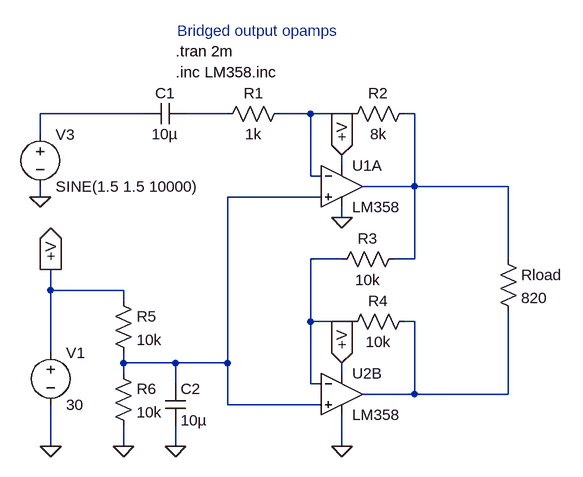
[diagram p0: schematic bridge_output_opamp.asc]
bridge_output_opamp.asc, the LTspice schematic file:
Version 4
SHEET 1 880 680
WIRE -512 -320 -672 -320
WIRE -384 -320 -448 -320
WIRE -256 -320 -304 -320
WIRE -192 -320 -256 -320
WIRE -96 -320 -112 -320
WIRE -672 -288 -672 -320
WIRE -208 -240 -208 -256
WIRE -256 -224 -256 -320
WIRE -240 -224 -256 -224
WIRE -96 -208 -96 -320
WIRE -96 -208 -176 -208
WIRE 48 -208 -96 -208
WIRE -672 -192 -672 -208
WIRE -240 -192 -384 -192
WIRE -208 -160 -208 -176
WIRE -208 -96 -256 -96
WIRE -96 -96 -96 -208
WIRE -96 -96 -128 -96
WIRE 48 -96 48 -208
WIRE -656 -48 -656 -80
WIRE -544 -48 -656 -48
WIRE -544 -32 -544 -48
WIRE -256 0 -256 -96
WIRE -192 0 -256 0
WIRE -96 0 -112 0
WIRE -656 48 -656 -48
WIRE -544 64 -544 48
WIRE -464 64 -544 64
WIRE -384 64 -384 -192
WIRE -384 64 -464 64
WIRE -544 80 -544 64
WIRE -208 80 -208 64
WIRE -464 96 -464 64
WIRE -256 96 -256 0
WIRE -240 96 -256 96
WIRE -96 112 -96 0
WIRE -96 112 -176 112
WIRE 48 112 48 -16
WIRE 48 112 -96 112
WIRE -384 128 -384 64
WIRE -240 128 -384 128
WIRE -656 192 -656 128
WIRE -544 192 -544 160
WIRE -464 192 -464 160
WIRE -208 192 -208 144
FLAG -656 192 0
FLAG -208 64 +V
IOPIN -208 64 In
FLAG -656 -80 +V
IOPIN -656 -80 Out
FLAG -208 -256 +V
IOPIN -208 -256 In
FLAG -544 192 0
FLAG -464 192 0
FLAG -672 -192 0
FLAG -208 -160 0
FLAG -208 192 0
SYMBOL voltage -656 32 R0
WINDOW 123 0 0 Left 2
WINDOW 39 0 0 Left 2
SYMATTR InstName V1
SYMATTR Value 30
SYMBOL res -96 -16 R90
WINDOW 0 0 56 VBottom 2
WINDOW 3 32 56 VTop 2
SYMATTR InstName R4
SYMATTR Value 10k
SYMBOL res -112 -112 R90
WINDOW 0 0 56 VBottom 2
WINDOW 3 32 56 VTop 2
SYMATTR InstName R3
SYMATTR Value 10k
SYMBOL res -96 -336 R90
WINDOW 0 0 56 VBottom 2
WINDOW 3 32 56 VTop 2
SYMATTR InstName R2
SYMATTR Value 8k
SYMBOL res -288 -336 R90
WINDOW 0 0 56 VBottom 2
WINDOW 3 32 56 VTop 2
SYMATTR InstName R1
SYMATTR Value 1k
SYMBOL voltage -672 -304 R0
WINDOW 123 0 0 Left 2
WINDOW 39 0 0 Left 2
SYMATTR InstName V3
SYMATTR Value SINE(1.5 1.5 10000)
SYMBOL res 32 -112 R0
SYMATTR InstName Rload
SYMATTR Value 820
SYMBOL cap -448 -336 R90
WINDOW 0 0 32 VBottom 2
WINDOW 3 32 32 VTop 2
SYMATTR InstName C1
SYMATTR Value 10µ
SYMBOL res -560 -48 R0
SYMATTR InstName R5
SYMATTR Value 10k
SYMBOL res -560 64 R0
SYMATTR InstName R6
SYMATTR Value 10k
SYMBOL cap -480 96 R0
SYMATTR InstName C2
SYMATTR Value 10µ
SYMBOL Opamps\\opamp2 -208 -272 R0
SYMATTR InstName U1A
SYMATTR Value LM358
SYMATTR SpiceModel LM358
SYMBOL Opamps\\opamp2 -208 48 R0
SYMATTR InstName U2B
SYMATTR Value LM358
SYMATTR SpiceModel LM358
TEXT -464 -416 Left 2 !.tran 2m
TEXT -336 -432 Bottom 2 ;Bridged output opamps
TEXT -464 -384 Left 2 !.inc LM358.inc

The netlist it stands for:
* bridge_output_opamp.asc
V1 +V 0 30
R4 N007 N006 10k
R3 N004 N006 10k
R2 N004 N003 8k
R1 N003 N002 1k
V3 N001 0 SINE(1.5 1.5 10000)
Rload N004 N007 820
C1 N002 N001 10µ
R5 +V N005 10k
R6 N005 0 10k
C2 N005 0 10µ
XU1A N005 N003 +V 0 N004 LM358 LM358  ; pins In+ In- V+ V- OUT
XU2B N005 N006 +V 0 N007 LM358 LM358  ; pins In+ In- V+ V- OUT
.tran 2m
* Bridged output opamps
.inc LM358.inc
.backanno
.end